# Altium schematic sheet 红外接收.SchDoc
size A4
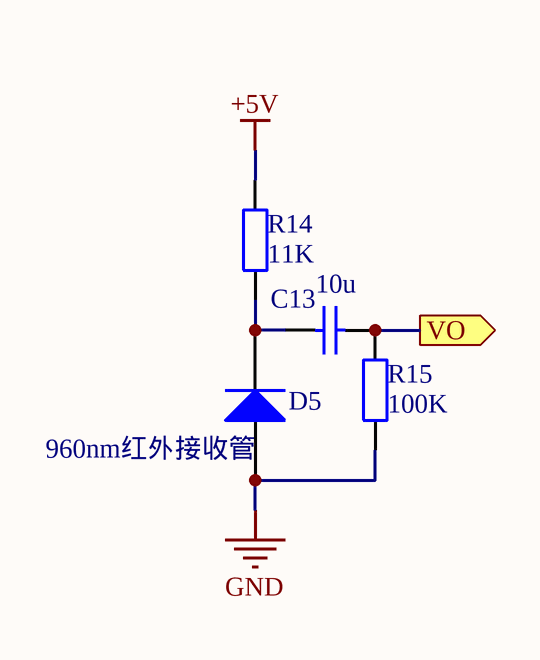
[diagram p0: 红外接收.SchDoc]

## Parts
C13  独石电容  [独石电容]  (value not drawn)
D5  960nm红外接收管  [DO-41]
R14  value 11K  [AXIAL-0.4]  (hidden comment: Res2)
R15  value 100K  [AXIAL-0.4]  (hidden comment: Res2)

## Ports
VO (out)

## Nets
+5V: R14.2
GND: D5.1(A) R15.1
VO: C13.2 R15.2 ; port VO
NetC13_1: C13.1 D5.2(K) R14.1

## Notes on the sheet
- 标题
- 日期
- 红外数字模拟接收一体机
- 2015 5 29
- 作者
- 模电组
- 单位
- 电子技术协会
- (in symbol 独石电容) 10u

## Library data of the parts
D5 = Diode 1N4001: 1 Amp General Purpose Rectifier; Published: 8-Jun-2000; LatestRevisionDate: 17-Jul-2002; LatestRevisionNote: Re-released for DXP Platform.; DatasheetDocument: 1998; PackageDocument: Aug-1999; PackageReference: DO-41; Publisher: Altium Limited; Code_JEDEC: DO-204-AL; ComponentLink1Description: Manufacturer Link; ComponentLink1URL: http://www.fairchildsemi.com/; ComponentLink2Description: Datasheet; ComponentLink2URL: http://www.fairchildsemi.com/ds/1N%2F1N4001.pdf
R14 R15 = Res2: Resistor; Published: 8-Jun-2000; LatestRevisionDate: 17-Jul-2002; LatestRevisionNote: Re-released for DXP Platform.; PackageReference: AXIAL-0.4; Publisher: Altium Limited